# EasyEDA schematic schematic.json
TITLE: keyboard; REV: 1.0; Date: 2024-04-10; Sheet: 1/1; Drawn By: bowiedev; Company: bowie
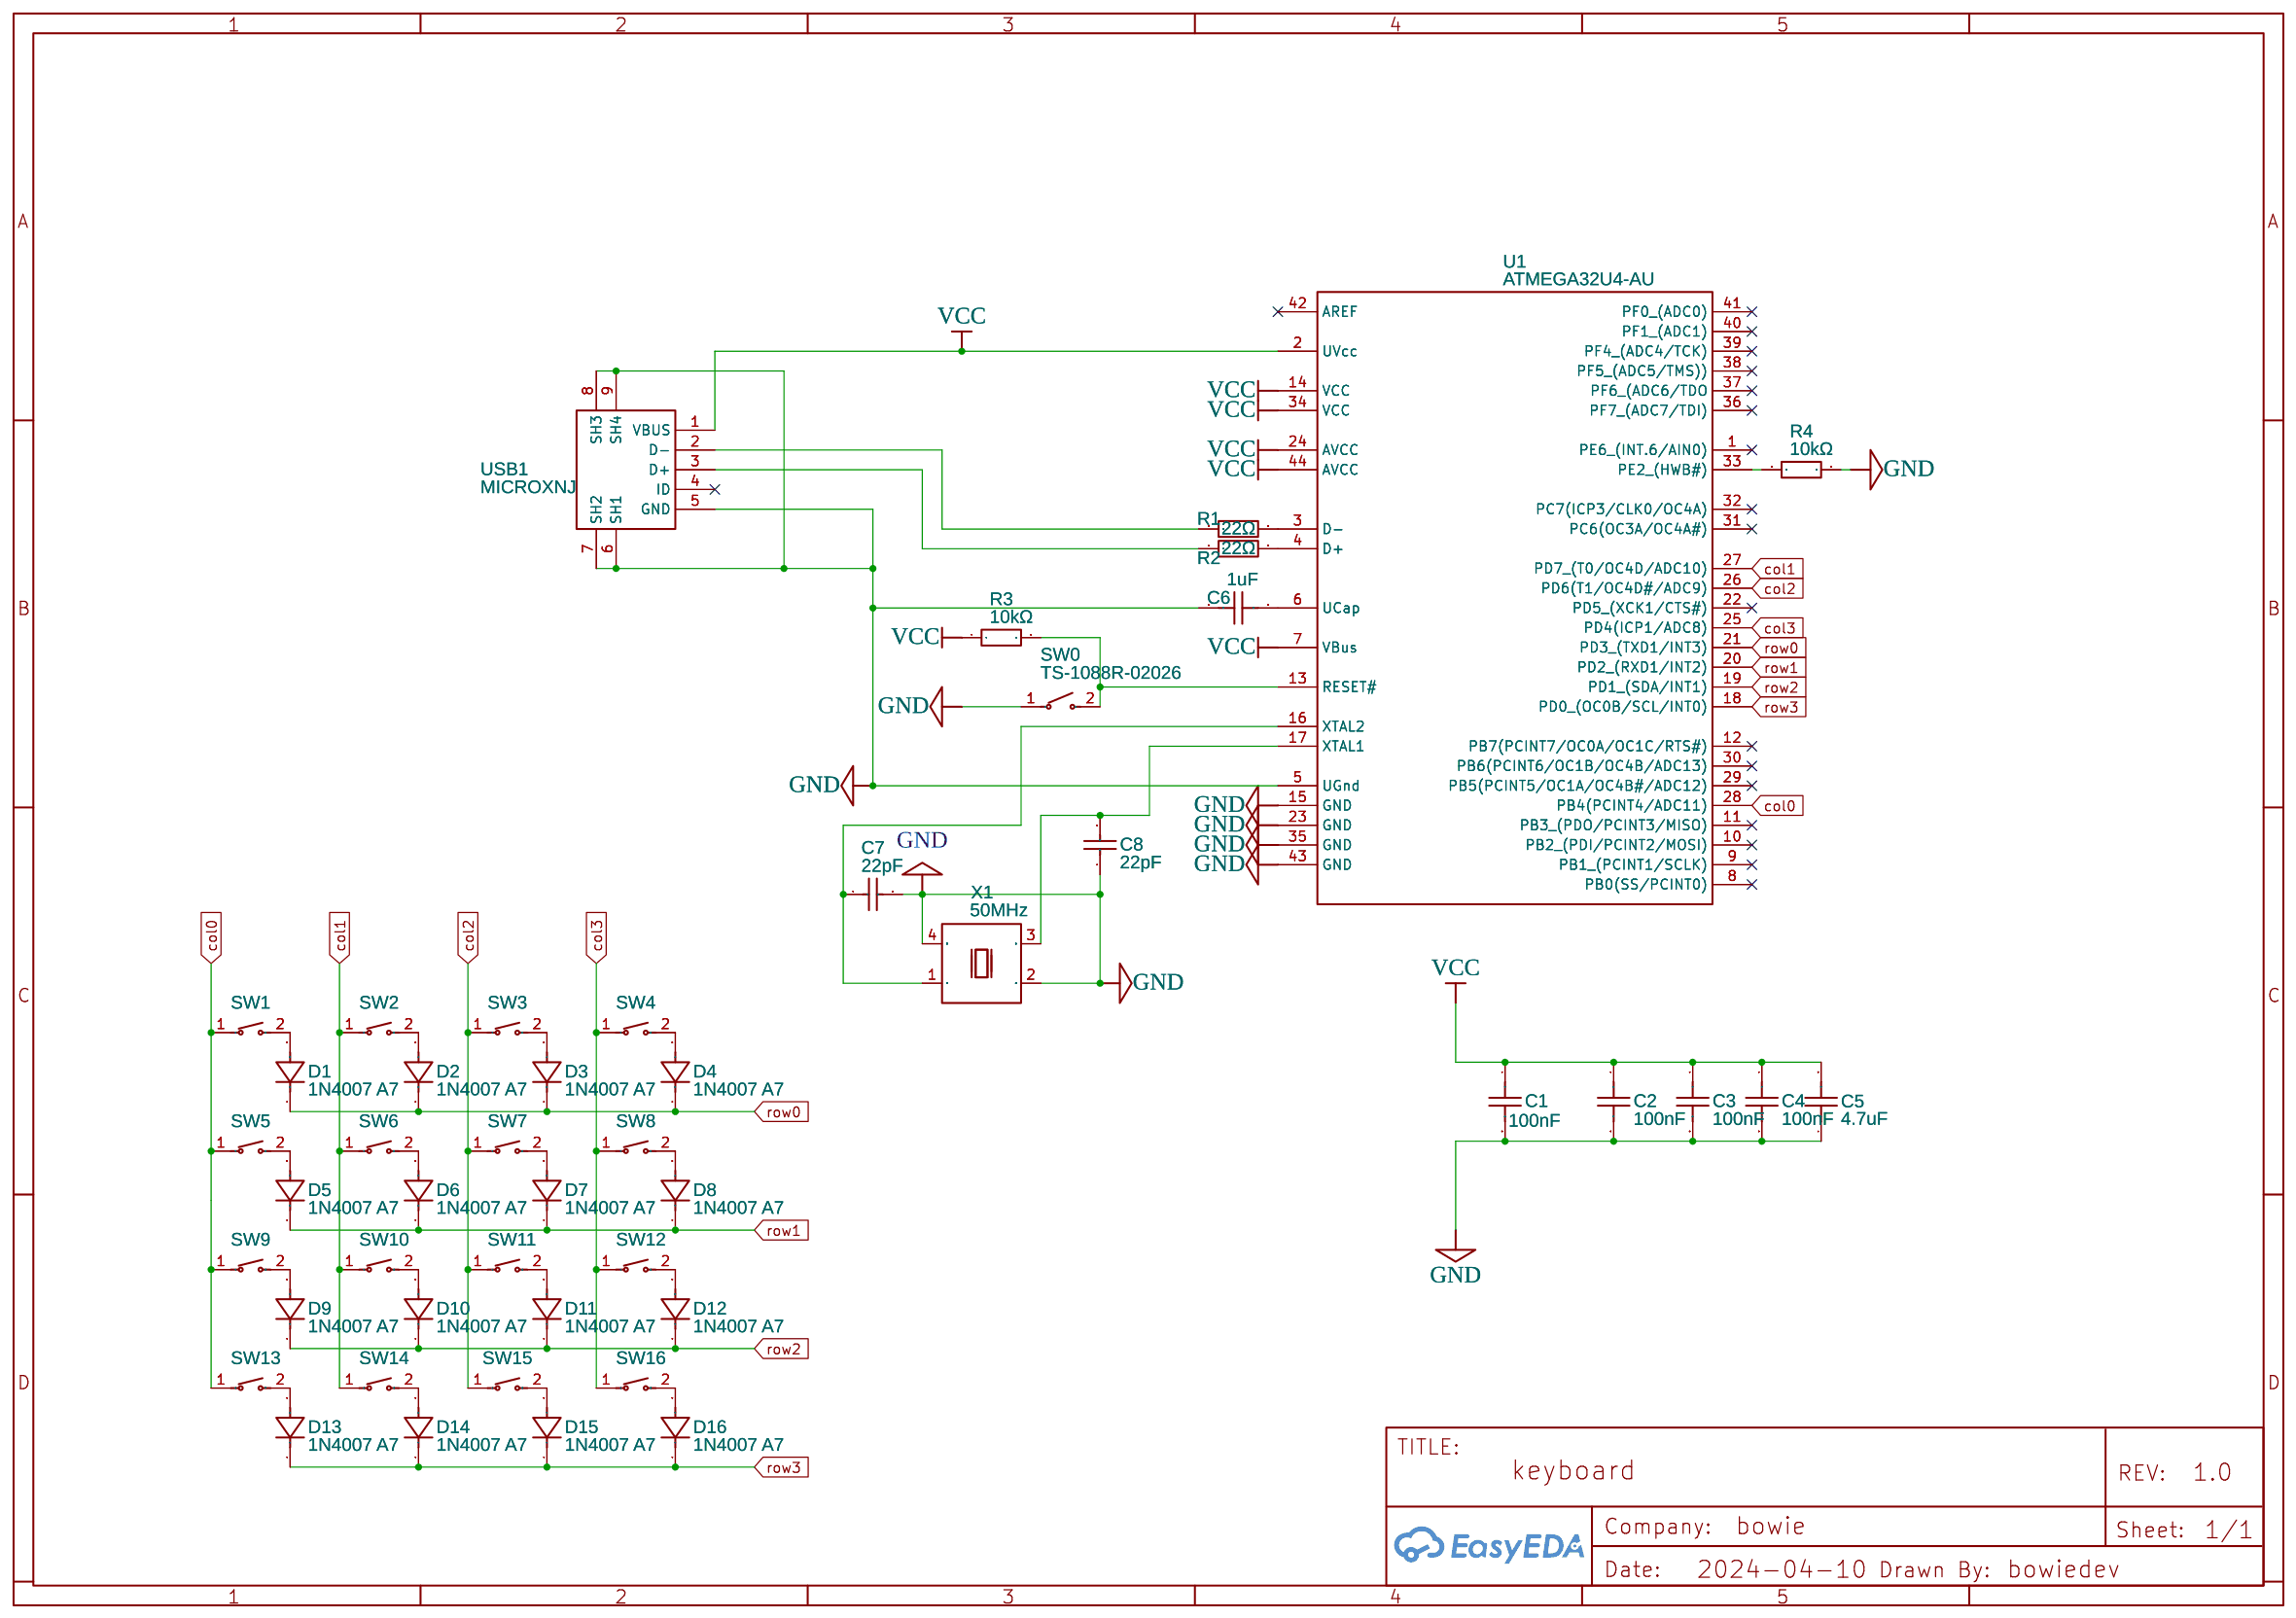
[diagram p0: schematic sheet]

## Parts
C1  100nF  [C0402]
C2  100nF  [C0402]
C3  100nF  [C0402]
C4  100nF  [C0402]
C5  4.7uF  [C0805]
C6  1uF  [C0603]
C7  22pF  [C0402]
C8  22pF  [C0402]
D1  1N4007 A7  [SOD-123FL_L2.8-W1.8-LS3.7-RD]
D2  1N4007 A7  [SOD-123FL_L2.8-W1.8-LS3.7-RD]
D3  1N4007 A7  [SOD-123FL_L2.8-W1.8-LS3.7-RD]
D4  1N4007 A7  [SOD-123FL_L2.8-W1.8-LS3.7-RD]
D5  1N4007 A7  [SOD-123FL_L2.8-W1.8-LS3.7-RD]
D6  1N4007 A7  [SOD-123FL_L2.8-W1.8-LS3.7-RD]
D7  1N4007 A7  [SOD-123FL_L2.8-W1.8-LS3.7-RD]
D8  1N4007 A7  [SOD-123FL_L2.8-W1.8-LS3.7-RD]
D9  1N4007 A7  [SOD-123FL_L2.8-W1.8-LS3.7-RD]
D10  1N4007 A7  [SOD-123FL_L2.8-W1.8-LS3.7-RD]
D11  1N4007 A7  [SOD-123FL_L2.8-W1.8-LS3.7-RD]
D12  1N4007 A7  [SOD-123FL_L2.8-W1.8-LS3.7-RD]
D13  1N4007 A7  [SOD-123FL_L2.8-W1.8-LS3.7-RD]
D14  1N4007 A7  [SOD-123FL_L2.8-W1.8-LS3.7-RD]
D15  1N4007 A7  [SOD-123FL_L2.8-W1.8-LS3.7-RD]
D16  1N4007 A7  [SOD-123FL_L2.8-W1.8-LS3.7-RD]
R1  22Ω  [R0805]
R2  22Ω  [R0805]
R3  10kΩ  [R0805]
R4  10kΩ  [R0805]
SW0  TS-1088R-02026  [SW-SMD_L3.9-W3.0-P4.45]
SW1  CPG151101D93  [SW-TH_CPG151101D9X]
SW2  CPG151101D93  [SW-TH_CPG151101D9X]
SW3  CPG151101D93  [SW-TH_CPG151101D9X]
SW4  CPG151101D93  [SW-TH_CPG151101D9X]
SW5  CPG151101D93  [SW-TH_CPG151101D9X]
SW6  CPG151101D93  [SW-TH_CPG151101D9X]
SW7  CPG151101D93  [SW-TH_CPG151101D9X]
SW8  CPG151101D93  [SW-TH_CPG151101D9X]
SW9  CPG151101D93  [SW-TH_CPG151101D9X]
SW10  CPG151101D93  [SW-TH_CPG151101D9X]
SW11  CPG151101D93  [SW-TH_CPG151101D9X]
SW12  CPG151101D93  [SW-TH_CPG151101D9X]
SW13  CPG151101D93  [SW-TH_CPG151101D9X]
SW14  CPG151101D93  [SW-TH_CPG151101D9X]
SW15  CPG151101D93  [SW-TH_CPG151101D9X]
SW16  CPG151101D93  [SW-TH_CPG151101D9X]
U1  ATMEGA32U4-AU  [QFP-44_L10.0-W10.0-P0.80-LS13.2-BL]
USB1  MICROXNJ  [MICRO-USB-SMD_MICROXNJ]
X1  50MHz  [OSC-SMD_4P-L5.0-W3.2-BL_SG5032]

## Library data of the parts
C1-C4 = C1005X7R1C104KT000F: Contributor: LCSC; Supplier: LCSC; Supplier Part: C338032; Manufacturer: TDK; JLCPCB Part Class: Extended Part
C5 = CS2012X5R475K500NRE: Contributor: LCSC; Supplier: LCSC; Supplier Part: C513770; Manufacturer: SAMWHA(三和); JLCPCB Part Class: Extended Part
C6 = CS1608X7R105K250NRB: Contributor: LCSC; Supplier: LCSC; Supplier Part: C513775; Manufacturer: SAMWHA(三和); JLCPCB Part Class: Extended Part
C7 C8 = 0402CG220J500NT: Supplier: LCSC; Manufacturer: FH(风华); Supplier Part: C1555; JLCPCB Part Class: Basic Part
D1-D16 = 1N4007 A7: Contributor: lcsc; Supplier: LCSC; Supplier Part: C2902912; Manufacturer: MSKSEMI(美森科)
R1 R2 = 0805W8J0220T5E: Supplier: LCSC; Manufacturer: UNI-ROYAL(厚声); Supplier Part: C25295; JLCPCB Part Class: Extended Part
R3 R4 = 0805W8F1002T5E: Supplier: LCSC; Manufacturer: UNI-ROYAL(厚声); Supplier Part: C17414; JLCPCB Part Class: Basic Part
SW0 = TS-1088R-02026: Contributor: LCSC; Supplier: LCSC; Supplier Part: C455280; Manufacturer: XUNPU(讯普); JLCPCB Part Class: Extended Part
SW1-SW16 = CPG151101D93: Contributor: LCSC; Supplier: LCSC; Supplier Part: C400237; Manufacturer: Kailh(凯华); JLCPCB Part Class: Extended Part
U1 = ATMEGA32U4-AU: Supplier: LCSC; Manufacturer: MICROCHIP(美国微芯); Supplier Part: C44854; JLCPCB Part Class: Extended Part
USB1 = MICROXNJ: Contributor: LCSC; Supplier: LCSC; Supplier Part: C404969; Manufacturer: SHOU HAN(首韩); Manufacturer Part: MicroXNJ; JLCPCB Part Class: Extended Part
X1 = OVETGLJTNF-50MHZ: Contributor: LCSC; Supplier: LCSC; Supplier Part: C117891; Manufacturer: TAITIEN(泰艺电子); JLCPCB Part Class: Extended Part

## Nets
GND: C1.2 C2.2 C3.2 C4.2 C5.1 C6.1 C7.2 C8.1 R4.2 SW0.1 U1.5(UGnd) U1.15(GND) U1.23(GND) U1.35(GND) U1.43(GND) USB1.5(GND) USB1.6(SH1) USB1.7(SH2) USB1.8(SH3) USB1.9(SH4) X1.2(GND) X1.4(VCC)
VCC: C1.1 C2.1 C3.1 C4.1 C5.2 R3.1 U1.2(UVcc) U1.7(VBus) U1.14(VCC) U1.24(AVCC) U1.34(VCC) U1.44(AVCC) USB1.1(VBUS)
col0: SW1.1 SW5.1 SW9.1 SW13.1 U1.28(PB4(PCINT4/ADC11))
col1: SW2.1 SW6.1 SW10.1 SW14.1 U1.27(PD7 (T0/OC4D/ADC10))
col2: SW3.1 SW7.1 SW11.1 SW15.1 U1.26(PD6(T1/OC4D#/ADC9))
col3: SW4.1 SW8.1 SW12.1 SW16.1 U1.25(PD4(ICP1/ADC8))
row0: D1.1(K) D2.1(K) D3.1(K) D4.1(K) U1.21(PD3 (TXD1/INT3))
row1: D5.1(K) D6.1(K) D7.1(K) D8.1(K) U1.20(PD2 (RXD1/INT2))
row2: D9.1(K) D10.1(K) D11.1(K) D12.1(K) U1.19(PD1 (SDA/INT1))
row3: D13.1(K) D14.1(K) D15.1(K) D16.1(K) U1.18(PD0 (OC0B/SCL/INT0))
Net-(C6-2): C6.2 U1.6(UCap)
Net-(C7-1): C7.1 U1.16(XTAL2) X1.1(tri)
Net-(C8-2): C8.2 U1.17(XTAL1) X1.3(OUT)
Net-(D1-2): D1.2(A) SW1.2
Net-(D2-2): D2.2(A) SW2.2
Net-(D3-2): D3.2(A) SW3.2
Net-(D4-2): D4.2(A) SW4.2
Net-(D5-2): D5.2(A) SW5.2
Net-(D6-2): D6.2(A) SW6.2
Net-(D7-2): D7.2(A) SW7.2
Net-(D8-2): D8.2(A) SW8.2
Net-(D9-2): D9.2(A) SW9.2
Net-(D10-2): D10.2(A) SW10.2
Net-(D11-2): D11.2(A) SW11.2
Net-(D12-2): D12.2(A) SW12.2
Net-(D13-2): D13.2(A) SW13.2
Net-(D14-2): D14.2(A) SW14.2
Net-(D15-2): D15.2(A) SW15.2
Net-(D16-2): D16.2(A) SW16.2
Net-(R1-1): R1.1 USB1.2(D-)
Net-(R1-2): R1.2 U1.3(D-)
Net-(R2-1): R2.1 USB1.3(D+)
Net-(R2-2): R2.2 U1.4(D+)
Net-(R3-2): R3.2 SW0.2 U1.13(RESET#)
Net-(R4-1): R4.1 U1.33(PE2 (HWB#))

Not connected (* = marked no-connect by the designer): U1 1(PE6 (INT.6/AIN0))* 8(PB0(SS/PCINT0))* 9(PB1 (PCINT1/SCLK))* 10(PB2 (PDI/PCINT2/MOSI))* 11(PB3 (PDO/PCINT3/MISO))* 12(PB7(PCINT7/OC0A/OC1C/RTS#))* 22(PD5 (XCK1/CTS#))* 29(PB5(PCINT5/OC1A/OC4B#/ADC12))* 30(PB6(PCINT6/OC1B/OC4B/ADC13))* 31(PC6(OC3A/OC4A#))* 32(PC7(ICP3/CLK0/OC4A))* 36(PF7 (ADC7/TDI))* 37(PF6 (ADC6/TDO)* 38(PF5 (ADC5/TMS)))* 39(PF4 (ADC4/TCK))* 40(PF1 (ADC1))* 41(PF0 (ADC0))* 42(AREF)*; USB1 4(ID)*
